# Altium schematic sheet TITLE.SchDoc
size Tabloid; SheetNumber: 1; SheetTotal: 23; Sheet_Name: TITLE PAGE; Size: 11x17
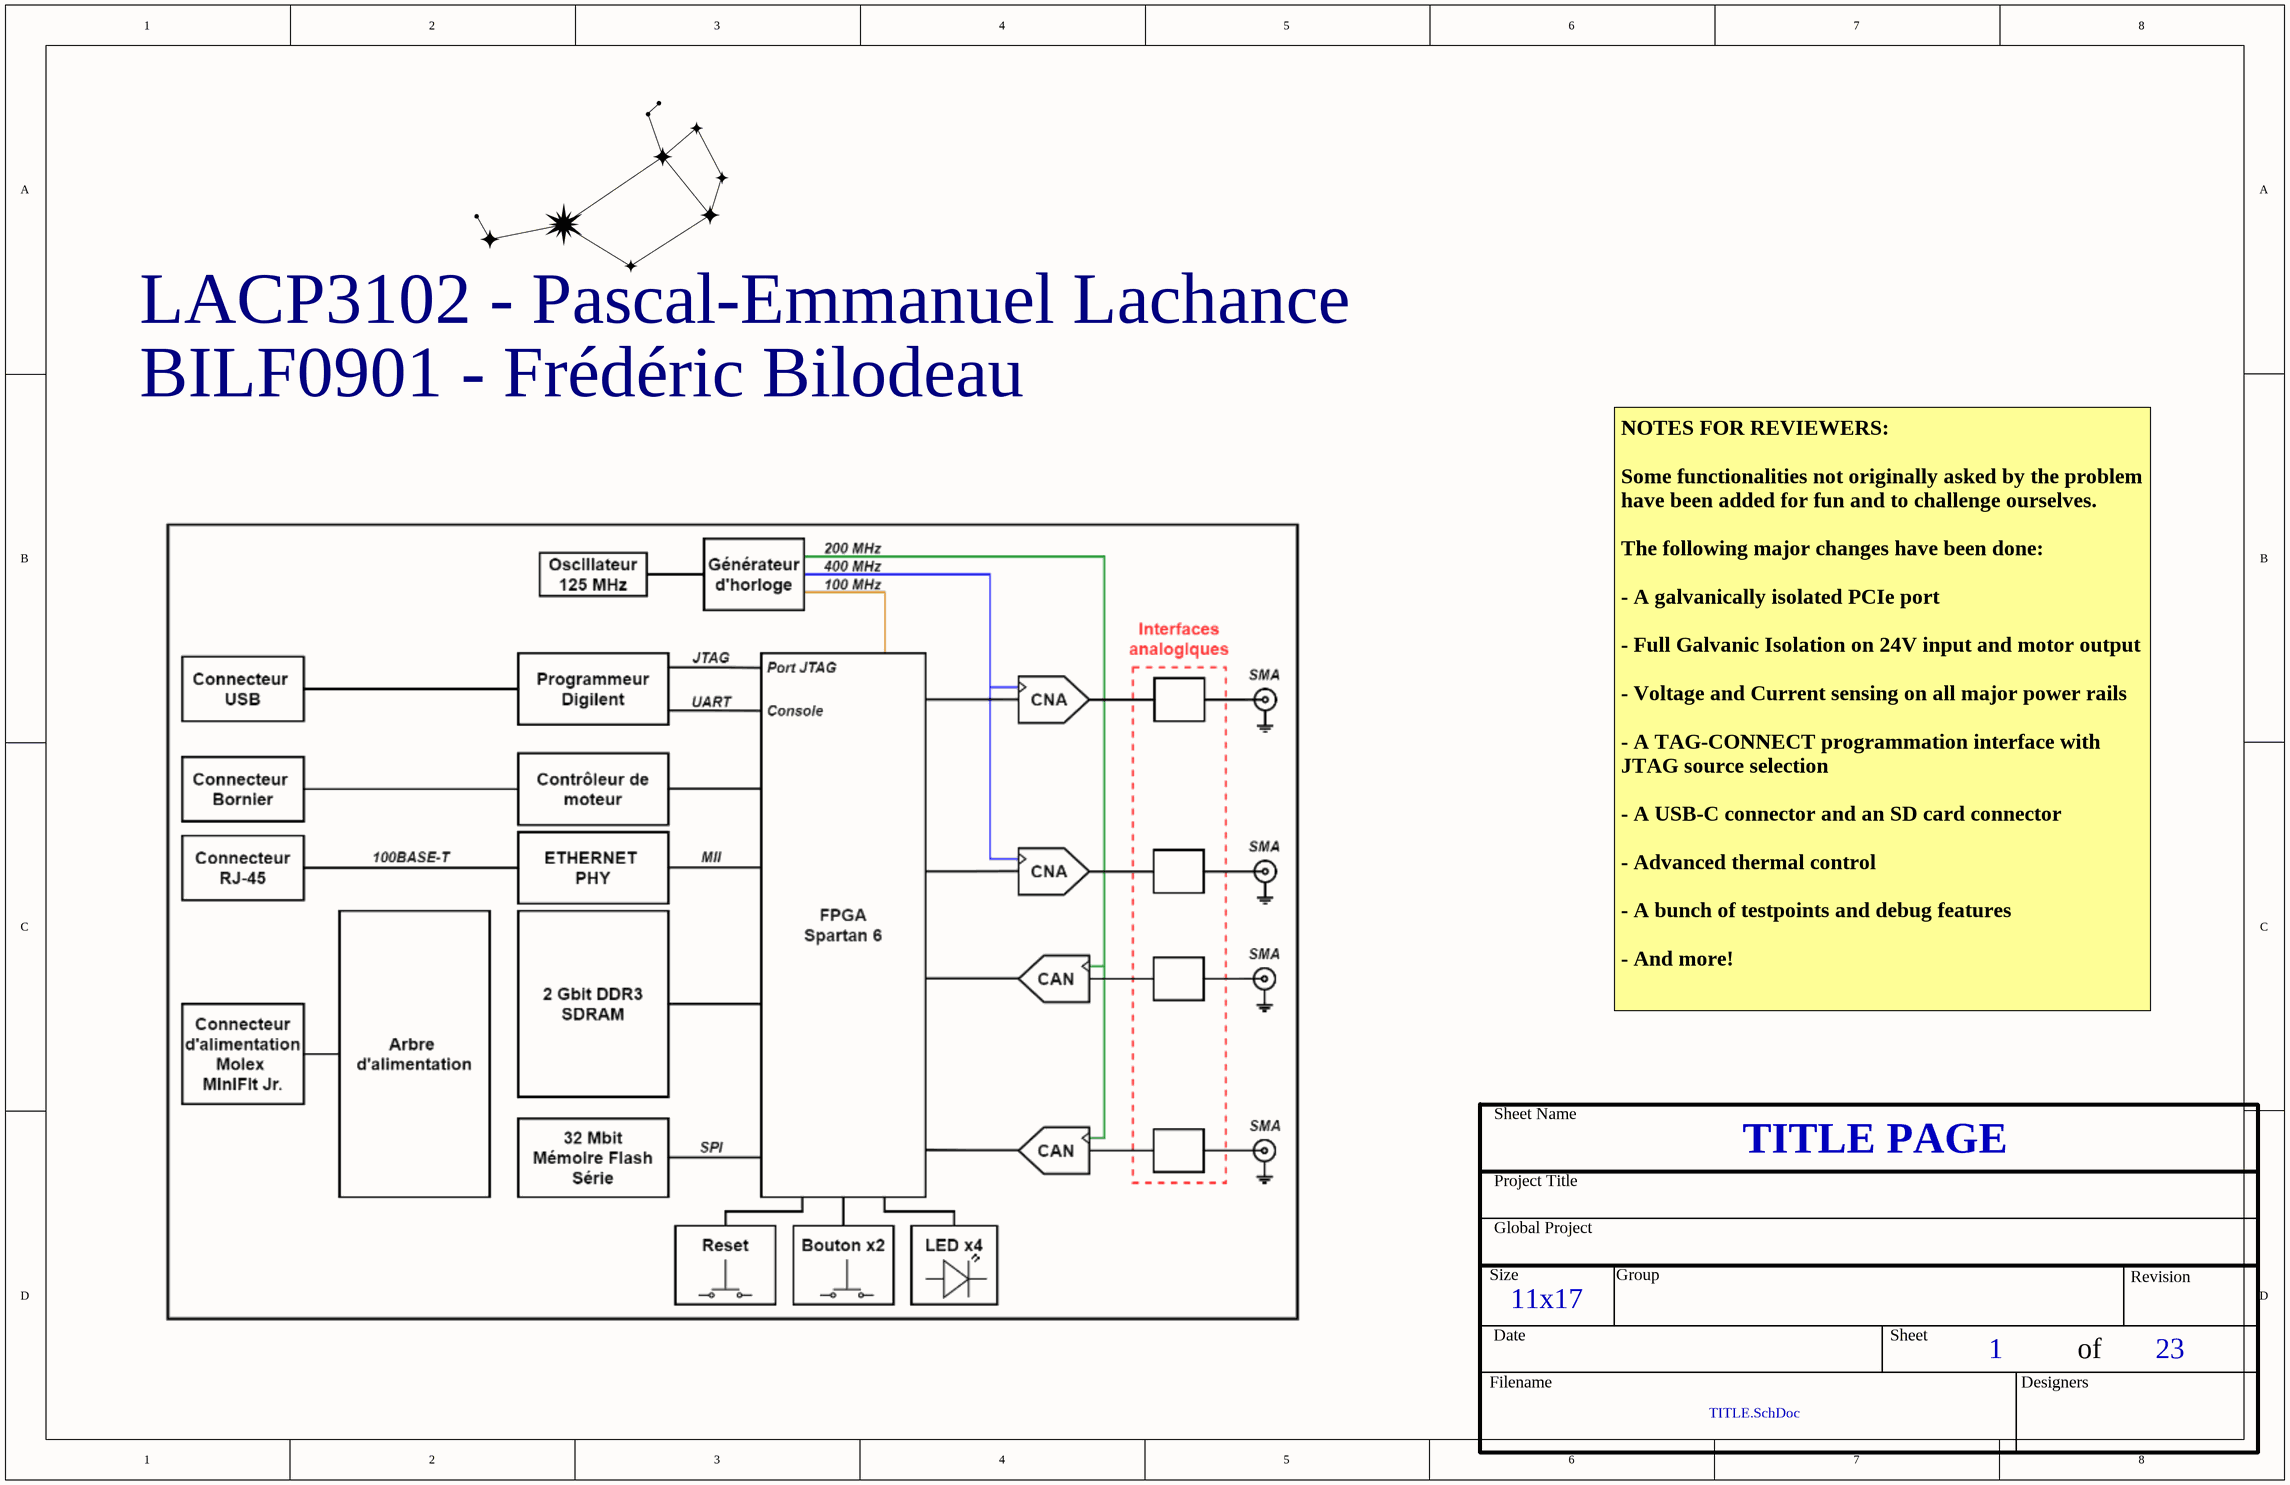
[diagram p0: TITLE.SchDoc]

## Sub-sheets
Designator = INFO.SchDoc: no entries
Designator = OVERVIEW.SchDoc: no entries

## Notes on the sheet
- LACP3102 - Pascal-Emmanuel Lachance
- BILF0901 - Frédéric Bilodeau
- NOTES FOR REVIEWERS:
  Some functionalities not originally asked by the problem have been added for fun and to challenge ourselves.
  The following major changes have been done:
  - A galvanically isolated PCIe port
  - Full Galvanic Isolation on 24V input and motor output
  - Voltage and Current sensing on all major power rails
  - A TAG-CONNECT programmation interface with JTAG source selection
  - A USB-C connector and an SD card connector
  - Advanced thermal control
  - A bunch of testpoints and debug features
  - And more!
- Sheet Name
- Project Title
- Global Project
- Size
- Group
- Revision
- Date
- Sheet
- of
- Filename
- Designers